# Altium schematic sheet Main.SchDoc
size A4
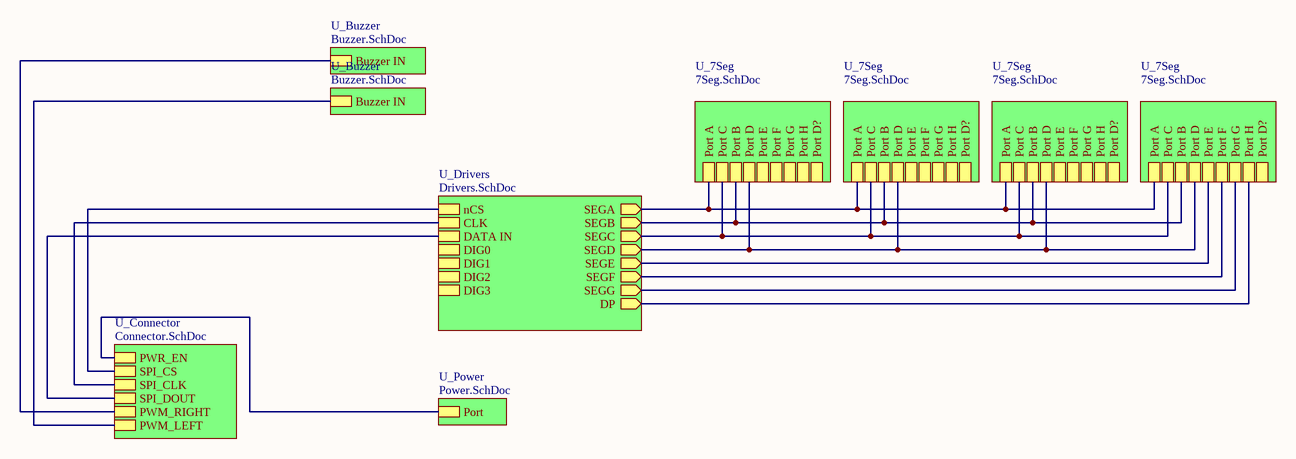
[diagram p0: Main.SchDoc]

## Sub-sheets
U_7Seg = 7Seg.SchDoc: Port A, Port C, Port B, Port D, Port E, Port F, Port G, Port H, Port D?
U_7Seg = 7Seg.SchDoc: Port A, Port C, Port B, Port D, Port E, Port F, Port G, Port H, Port D?
U_7Seg = 7Seg.SchDoc: Port A, Port C, Port B, Port D, Port E, Port F, Port G, Port H, Port D?
U_7Seg = 7Seg.SchDoc: Port A, Port C, Port B, Port D, Port E, Port F, Port G, Port H, Port D?
U_Buzzer = Buzzer.SchDoc: Buzzer IN
U_Buzzer = Buzzer.SchDoc: Buzzer IN
U_Connector = Connector.SchDoc: PWR_EN, SPI_CS, SPI_CLK, SPI_DOUT, PWM_RIGHT, PWM_LEFT
U_Drivers = Drivers.SchDoc: nCS, CLK, DATA IN, SEGA (out), DIG0, DIG1, DIG2, DIG3, SEGB (out), SEGC (out), SEGD (out), SEGE (out), SEGF (out), SEGG (out), DP (out)
U_Power = Power.SchDoc: Port

## Nets
(unnamed): sheet U_Buzzer/Buzzer IN, sheet U_Connector/PWM_RIGHT
(unnamed): sheet U_7Seg/Port A, sheet U_7Seg/Port A, sheet U_7Seg/Port A, sheet U_7Seg/Port A, sheet U_Drivers/SEGA
(unnamed): sheet U_7Seg/Port C, sheet U_7Seg/Port C, sheet U_7Seg/Port C, sheet U_7Seg/Port C, sheet U_Drivers/SEGC
(unnamed): sheet U_7Seg/Port B, sheet U_7Seg/Port B, sheet U_7Seg/Port B, sheet U_7Seg/Port B, sheet U_Drivers/SEGB
(unnamed): sheet U_7Seg/Port D, sheet U_7Seg/Port D, sheet U_7Seg/Port D, sheet U_7Seg/Port D, sheet U_Drivers/SEGD
(unnamed): sheet U_7Seg/Port E, sheet U_Drivers/SEGE
(unnamed): sheet U_7Seg/Port F, sheet U_Drivers/SEGF
(unnamed): sheet U_7Seg/Port G, sheet U_Drivers/SEGG
(unnamed): sheet U_7Seg/Port H, sheet U_Drivers/DP
(unnamed): sheet U_Connector/PWR_EN, sheet U_Power/Port
(unnamed): sheet U_Connector/SPI_CS, sheet U_Drivers/nCS
(unnamed): sheet U_Connector/SPI_CLK, sheet U_Drivers/CLK
(unnamed): sheet U_Connector/SPI_DOUT, sheet U_Drivers/DATA IN
(unnamed): sheet U_Connector/PWM_LEFT, sheet U_Buzzer/Buzzer IN